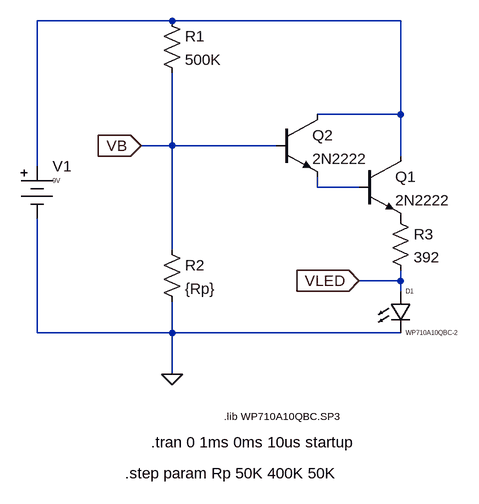
[diagram p0: schematic Photosensor.asc]
Photosensor.asc, the LTspice schematic file:
Version 4
SHEET 1 936 680
WIRE -208 -128 -416 -128
WIRE 144 -128 -208 -128
WIRE 144 16 144 -128
WIRE 144 16 16 16
WIRE -208 64 -208 -48
WIRE -208 64 -256 64
WIRE -48 64 -208 64
WIRE 144 80 144 16
WIRE -416 96 -416 -128
WIRE 16 128 16 112
WIRE 80 128 16 128
WIRE -208 224 -208 64
WIRE 144 272 144 256
WIRE 144 272 80 272
WIRE 144 288 144 272
WIRE -416 352 -416 176
WIRE -208 352 -208 304
WIRE -208 352 -416 352
WIRE 144 352 -208 352
WIRE -208 416 -208 352
FLAG -208 416 0
FLAG -256 64 VB
IOPIN -256 64 In
FLAG 80 272 VLED
IOPIN 80 272 In
SYMBOL battery -416 80 R0
WINDOW 123 0 0 Left 0
WINDOW 3 24 38 Left 0
SYMATTR Value 9V
SYMATTR InstName V1
SYMATTR SpiceLine Rser=0
SYMBOL res 128 160 R0
SYMATTR InstName R3
SYMATTR Value 392
SYMBOL res -224 208 R0
SYMATTR InstName R2
SYMATTR Value {Rp}
SYMBOL npn 80 80 R0
SYMATTR InstName Q1
SYMATTR Value 2N2222
SYMBOL npn -48 16 R0
SYMATTR InstName Q2
SYMATTR Value 2N2222
SYMBOL res -224 -144 R0
SYMATTR InstName R1
SYMATTR Value 500K
SYMBOL LED 128 288 R0
WINDOW 0 24 0 Left 0
WINDOW 3 24 64 Left 0
SYMATTR InstName D1
SYMATTR Value WP710A10QBC-2
TEXT -128 480 Left 1 !.lib WP710A10QBC.SP3
TEXT -240 520 Left 2 !.tran 0 1ms 0ms 10us startup
TEXT -280 568 Left 2 !.step param Rp 50K 400K 50K

The netlist it stands for:
* Photosensor.asc
V1 N001 0 9V Rser=0
R3 P001 VLED 392
R2 VB 0 {Rp}
Q1 N001 N002 P001 0 2N2222
Q2 N001 VB N002 0 2N2222
R1 N001 VB 500K
D1 VLED 0 WP710A10QBC-2
.model D D
.lib standard.dio
.model NPN NPN
.model PNP PNP
.lib standard.bjt
.lib WP710A10QBC.SP3
.tran 0 1ms 0ms 10us startup
.step param Rp 50K 400K 50K
.backanno
.end